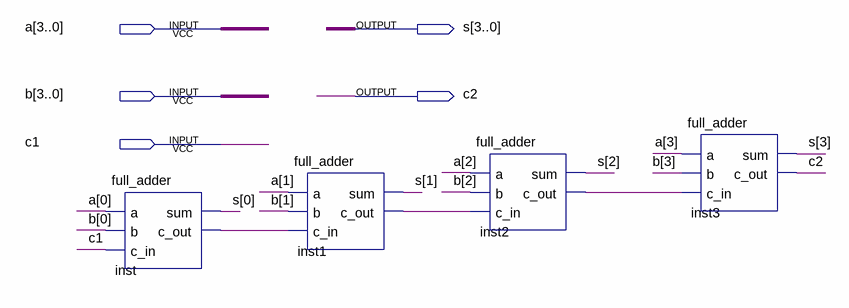
[diagram p0: schematic sheet]
// Quartus schematic full_adder4_dg.bdf as structural Verilog: 4 symbols, 5 pins
module full_adder4_dg (
  input  [3:0] a,
  input  [3:0] b,
  input  c1,
  output [3:0] s,
  output c2
);

  wire inst1_c_out, inst2_c_out, inst_c_out;

  full_adder inst (.a(a[0]), .b(b[0]), .c_in(c1), .sum(s[0]), .c_out(inst_c_out));
  full_adder inst1 (.a(a[1]), .b(b[1]), .c_in(inst_c_out), .sum(s[1]), .c_out(inst1_c_out));
  full_adder inst2 (.a(a[2]), .b(b[2]), .c_in(inst1_c_out), .sum(s[2]), .c_out(inst2_c_out));
  full_adder inst3 (.a(a[3]), .b(b[3]), .c_in(inst2_c_out), .sum(s[3]), .c_out(c2));
endmodule
